# Altium schematic sheet LTE_block_diagram.SchDoc
size Letter; SheetNumber: 1; SheetTotal: 6
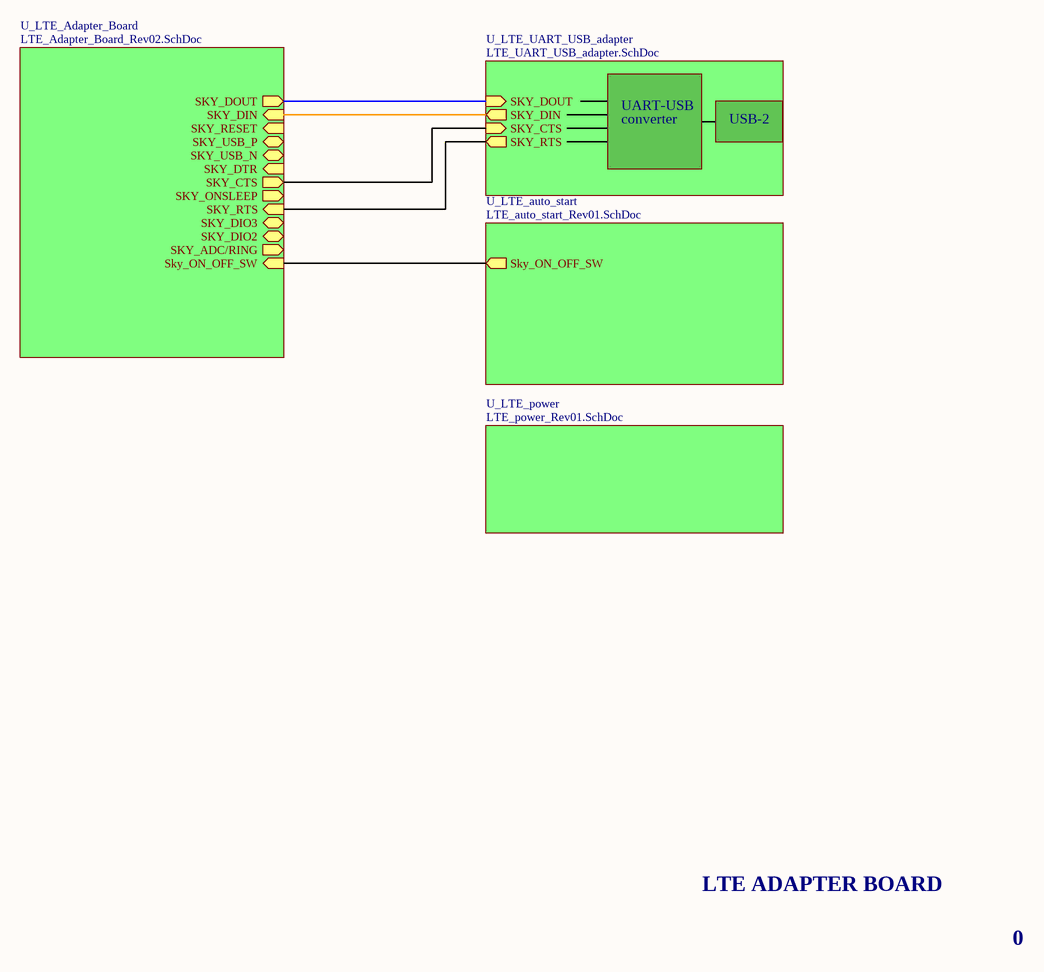
[diagram p0: LTE_block_diagram.SchDoc]

## Sub-sheets
U_LTE_Adapter_Board = LTE_Adapter_Board_Rev02.SchDoc: SKY_RESET (in), SKY_DOUT (out), SKY_DIN (in), SKY_RTS (in), SKY_CTS (out), SKY_DIO2 (bidir), SKY_DIO3 (bidir), SKY_ADC/RING (out), SKY_ONSLEEP (out), Sky_ON_OFF_SW (in), SKY_DTR (in), SKY_USB_N (bidir), SKY_USB_P (bidir)
U_LTE_auto_start = LTE_auto_start_Rev01.SchDoc: Sky_ON_OFF_SW (out)
U_LTE_power = LTE_power_Rev01.SchDoc: no entries
U_LTE_UART_USB_adapter = LTE_UART_USB_adapter.SchDoc: SKY_DOUT (in), SKY_DIN (out), SKY_CTS (in), SKY_RTS (out)

## Nets
(unnamed): sheet U_LTE_Adapter_Board/SKY_DOUT, sheet U_LTE_UART_USB_adapter/SKY_DOUT
(unnamed): sheet U_LTE_Adapter_Board/SKY_DIN, sheet U_LTE_UART_USB_adapter/SKY_DIN
(unnamed): sheet U_LTE_Adapter_Board/SKY_RTS, sheet U_LTE_UART_USB_adapter/SKY_RTS
(unnamed): sheet U_LTE_Adapter_Board/SKY_CTS, sheet U_LTE_UART_USB_adapter/SKY_CTS
(unnamed): sheet U_LTE_Adapter_Board/Sky_ON_OFF_SW, sheet U_LTE_auto_start/Sky_ON_OFF_SW

## Notes on the sheet
- UART-USB
- converter
- USB-2
- LTE ADAPTER BOARD
- 0